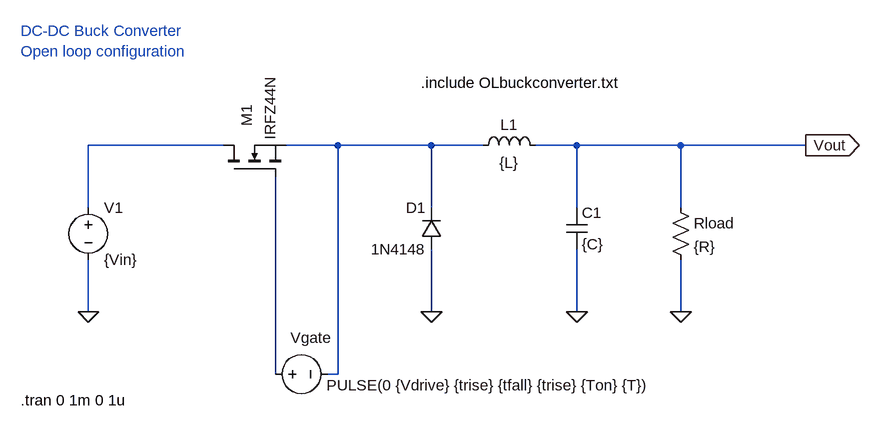
[diagram p0: schematic OLbuckconverter.asc]
OLbuckconverter.asc, the LTspice schematic file:
Version 4
SHEET 1 1264 680
WIRE 256 -64 48 -64
WIRE 432 -64 352 -64
WIRE 576 -64 432 -64
WIRE 656 -64 576 -64
WIRE 800 -64 736 -64
WIRE 960 -64 800 -64
WIRE 1152 -64 960 -64
WIRE 48 32 48 -64
WIRE 576 32 576 -64
WIRE 800 32 800 -64
WIRE 960 32 960 -64
WIRE 48 192 48 112
WIRE 576 192 576 96
WIRE 800 192 800 96
WIRE 960 192 960 112
WIRE 336 288 336 -16
WIRE 432 288 432 -64
WIRE 432 288 416 288
FLAG 576 192 0
FLAG 800 192 0
FLAG 960 192 0
FLAG 48 192 0
FLAG 1152 -64 Vout
IOPIN 1152 -64 Out
SYMBOL voltage 48 16 R0
WINDOW 123 0 0 Left 0
WINDOW 39 0 0 Left 0
SYMATTR InstName V1
SYMATTR Value {Vin}
SYMBOL ind 640 -48 R270
WINDOW 0 32 56 VTop 2
WINDOW 3 5 56 VBottom 2
SYMATTR InstName L1
SYMATTR Value {L}
SYMBOL cap 784 32 R0
SYMATTR InstName C1
SYMATTR Value {C}
SYMBOL res 944 16 R0
SYMATTR InstName Rload
SYMATTR Value {R}
SYMBOL diode 592 96 R180
WINDOW 0 24 64 Left 2
WINDOW 3 24 0 Left 2
SYMATTR InstName D1
SYMATTR Value 1N4148
SYMATTR Description Schottky diode
SYMATTR Type schottky
SYMBOL nmos 256 -16 R270
WINDOW 0 77 36 Left 2
SYMATTR InstName M1
SYMATTR Value IRFZ44N
SYMBOL voltage 320 288 R270
WINDOW 123 0 0 Left 0
WINDOW 39 0 0 Left 0
WINDOW 0 56 39 VRight 2
WINDOW 3 -17 95 VRight 2
SYMATTR InstName Vgate
SYMATTR Value PULSE(0 {Vdrive} {trise} {tfall} {trise} {Ton} {T})
TEXT -56 -240 Left 2 ;DC-DC Buck Converter\nOpen loop configuration
TEXT 560 -160 Left 2 !.include OLbuckconverter.txt
TEXT -56 328 Left 2 !.tran 0 1m 0 1u

The netlist it stands for:
* OLbuckconverter.asc
V1 N001 0 {Vin}
L1 N002 Vout {L}
C1 Vout 0 {C}
Rload Vout 0 {R}
D1 0 N002 1N4148
M1 N001 N003 N002 N002 IRFZ44N
Vgate N003 N002 PULSE(0 {Vdrive} {trise} {tfall} {trise} {Ton} {T})
.model D D
.lib standard.dio
.model NMOS NMOS
.model PMOS PMOS
.lib standard.mos
* DC-DC Buck Converter
* Open loop configuration
.include OLbuckconverter.txt
.tran 0 1m 0 1u
.backanno
.end